# EAGLE schematic BMS (EAGLE 7.5.0)
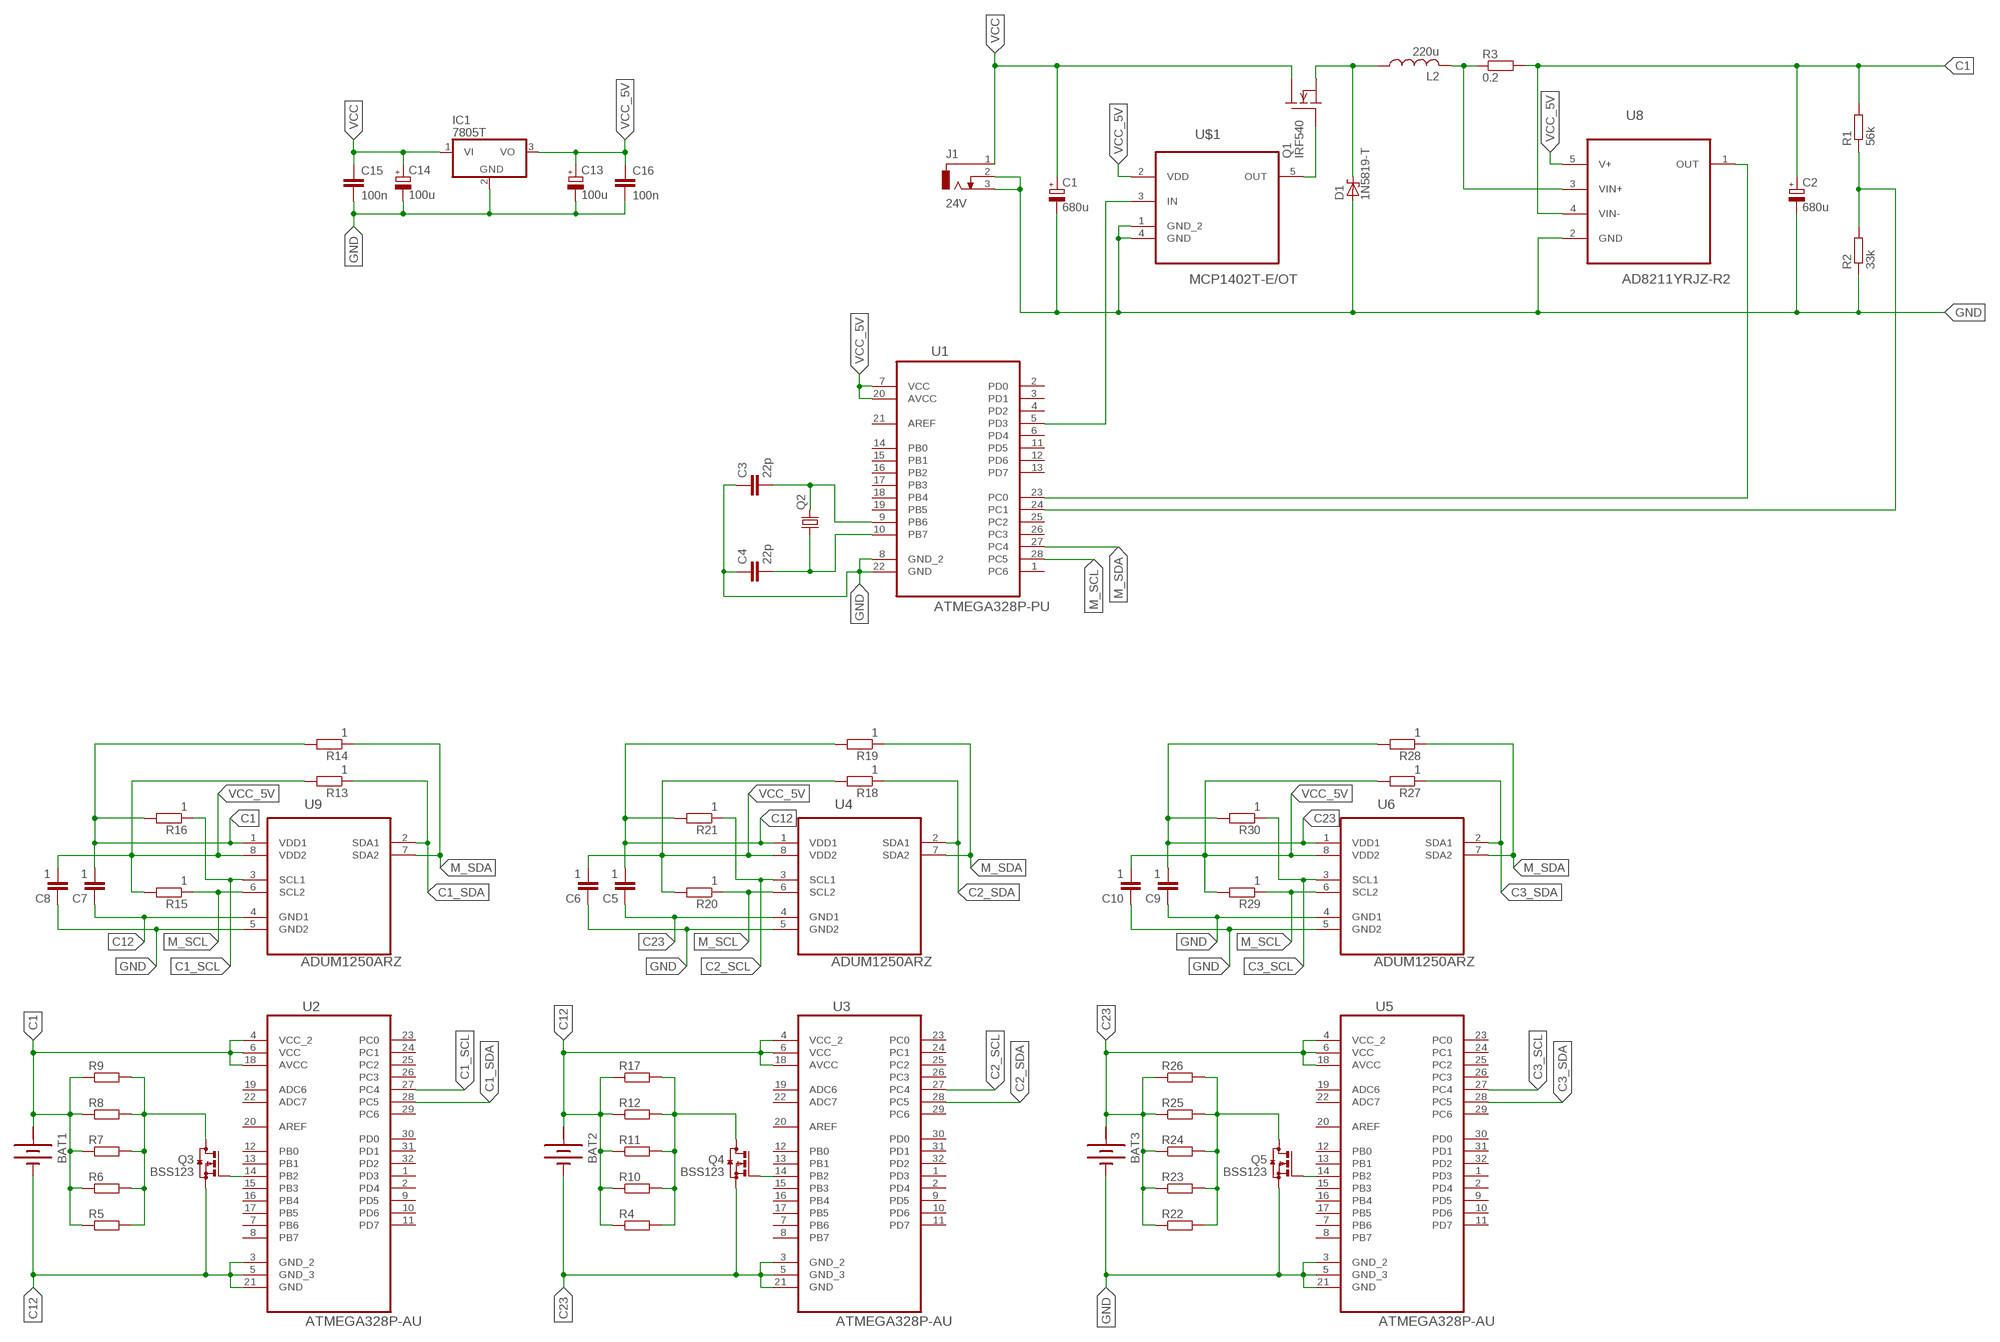
[diagram p0: schematic, sheet 1]

## Parts
BAT1  BATTERY  [BATTERY]
BAT2  BATTERY  [BATTERY]
BAT3  BATTERY  [BATTERY]
C1  680u  CPOL-EUE3.5-8  [E3,5-8]
C2  680u  CPOL-EUE3.5-8  [E3,5-8]
C3  22p  C-EUC0805  [C0805]
C4  22p  C-EUC0805  [C0805]
C5  1  C-EUC0805  [C0805]
C6  1  C-EUC0805  [C0805]
C7  1  C-EUC0805  [C0805]
C8  1  C-EUC0805  [C0805]
C9  1  C-EUC0805  [C0805]
C10  1  C-EUC0805  [C0805]
C13  100u  CPOL-EUB45181A  [B45181A]
C14  100u  CPOL-EUB45181A  [B45181A]
C15  100n  C-EUC0805  [C0805]
C16  100n  C-EUC0805  [C0805]
D1  1N5819-T  [DO41-7.6]
IC1  7805T  [TO220H]
J1  24V  DCJ0303  [DCJ0303]
L2  220u  L-USTJ9-U1  [TJ9-U1]
Q1  IRF540  [TO220]
Q2  CRYSTALHC49S  [HC49/S]
Q3  BSS123  [SOT23]
Q4  BSS123  [SOT23]
Q5  BSS123  [SOT23]
R1  56k  R-EU_R0805  [R0805]
R2  33k  R-EU_R0805  [R0805]
R3  0.2  R-EU_R0805  [R0805]
R4  R-EU_R0805  [R0805]
R5  R-EU_R0805  [R0805]
R6  R-EU_R0805  [R0805]
R7  R-EU_R0805  [R0805]
R8  R-EU_R0805  [R0805]
R9  R-EU_R0805  [R0805]
R10  R-EU_R0805  [R0805]
R11  R-EU_R0805  [R0805]
R12  R-EU_R0805  [R0805]
R13  1  R-EU_R0805  [R0805]
R14  1  R-EU_R0805  [R0805]
R15  1  R-EU_R0805  [R0805]
R16  1  R-EU_R0805  [R0805]
R17  R-EU_R0805  [R0805]
R18  1  R-EU_R0805  [R0805]
R19  1  R-EU_R0805  [R0805]
R20  1  R-EU_R0805  [R0805]
R21  1  R-EU_R0805  [R0805]
R22  R-EU_R0805  [R0805]
R23  R-EU_R0805  [R0805]
R24  R-EU_R0805  [R0805]
R25  R-EU_R0805  [R0805]
R26  R-EU_R0805  [R0805]
R27  1  R-EU_R0805  [R0805]
R28  1  R-EU_R0805  [R0805]
R29  1  R-EU_R0805  [R0805]
R30  1  R-EU_R0805  [R0805]
U1  ATMEGA328P-PU  [DIP254P762X457-28]
U2  ATMEGA328P-AU  [QFP80P900X900X120-32N]
U3  ATMEGA328P-AU  [QFP80P900X900X120-32N]
U4  ADUM1250ARZ  [SOIC127P600X175-8N]
U5  ATMEGA328P-AU  [QFP80P900X900X120-32N]
U6  ADUM1250ARZ  [SOIC127P600X175-8N]
U8  AD8211YRJZ-R2  [SOT95P280X145-5N]
U9  ADUM1250ARZ  [SOIC127P600X175-8N]
U$1  MCP1402T-E/OT  [SOT95P270X145-5N]

## Nets
C1: BAT1.+ C2.+ C7.2 R1.2 R3.2 R5.1 R6.1 R7.1 R8.1 R9.1 R14.2 R16.2 U2.4(VCC_2) U2.6(VCC) U2.18(AVCC) U8.4(VIN-) U9.1(VDD1)
C1_SCL: R16.1 U2.27(PC4) U9.3(SCL1)
C1_SDA: R13.1 U2.28(PC5) U9.2(SDA1)
C2_SCL: R21.1 U3.27(PC4) U4.3(SCL1)
C2_SDA: R18.1 U3.28(PC5) U4.2(SDA1)
C3_SCL: R30.1 U5.27(PC4) U6.3(SCL1)
C3_SDA: R27.1 U5.28(PC5) U6.2(SDA1)
C12: BAT1.- BAT2.+ C5.2 C7.1 Q3.2(S) R4.1 R10.1 R11.1 R12.1 R17.1 R19.2 R21.2 U2.3(GND_2) U2.5(GND_3) U2.21(GND) U3.4(VCC_2) U3.6(VCC) U3.18(AVCC) U4.1(VDD1) U9.4(GND1)
C23: BAT2.- BAT3.+ C5.1 C9.2 Q4.2(S) R22.1 R23.1 R24.1 R25.1 R26.1 R28.2 R30.2 U3.3(GND_2) U3.5(GND_3) U3.21(GND) U4.4(GND1) U5.4(VCC_2) U5.6(VCC) U5.18(AVCC) U6.1(VDD1)
GND: BAT3.- C1.- C2.- C3.1 C4.1 C6.1 C8.1 C9.1 C10.1 C13.- C14.- C15.2 C16.2 D1.A IC1.2(GND) J1.2 J1.3 Q5.2(S) R2.1 U1.8(GND_2) U1.22(GND) U4.5(GND2) U5.3(GND_2) U5.5(GND_3) U5.21(GND) U6.4(GND1) U6.5(GND2) U8.2(GND) U9.5(GND2) U$1.1(GND_2) U$1.4(GND)
M_SCL: R15.1 R20.1 R29.1 U1.28(PC5) U4.6(SCL2) U6.6(SCL2) U9.6(SCL2)
M_SDA: R14.1 R19.1 R28.1 U1.27(PC4) U4.7(SDA2) U6.7(SDA2) U9.7(SDA2)
N$2: C3.2 Q2.2 U1.9(PB6)
N$3: D1.C L2.1 Q1.3(S)
N$4: U1.5(PD3) U$1.3(IN)
N$5: Q1.1(G) U$1.5(OUT)
N$6: L2.2 R3.1 U8.3(VIN+)
N$7: R1.1 R2.2 U1.24(PC1)
N$8: C4.2 Q2.1 U1.10(PB7)
N$9: U1.23(PC0) U8.1(OUT)
N$13: Q3.3(D) R5.2 R6.2 R7.2 R8.2 R9.2
N$14: Q3.1(G) U2.14(PB2)
N$16: Q4.3(D) R4.2 R10.2 R11.2 R12.2 R17.2
N$17: Q4.1(G) U3.14(PB2)
N$24: Q5.3(D) R22.2 R23.2 R24.2 R25.2 R26.2
N$25: Q5.1(G) U5.14(PB2)
VCC: C1.+ C14.+ C15.1 IC1.1(VI) J1.1 Q1.2(D)
VCC_5V: C6.2 C8.2 C10.2 C13.+ C16.1 IC1.3(VO) R13.2 R15.2 R18.2 R20.2 R27.2 R29.2 U1.7(VCC) U1.20(AVCC) U4.8(VDD2) U6.8(VDD2) U8.5(V+) U9.8(VDD2) U$1.2(VDD)
Unconnected: U1.1(PC6) U1.2(PD0) U1.3(PD1) U1.4(PD2) U1.6(PD4) U1.11(PD5) U1.12(PD6) U1.13(PD7) U1.14(PB0) U1.15(PB1) U1.16(PB2) U1.17(PB3) U1.18(PB4) U1.19(PB5) U1.21(AREF) U1.25(PC2) U1.26(PC3) U2.1(PD3) U2.2(PD4) U2.7(PB6) U2.8(PB7) U2.9(PD5) U2.10(PD6) U2.11(PD7) U2.12(PB0) U2.13(PB1) U2.15(PB3) U2.16(PB4) U2.17(PB5) U2.19(ADC6) U2.20(AREF) U2.22(ADC7) U2.23(PC0) U2.24(PC1) U2.25(PC2) U2.26(PC3) U2.29(PC6) U2.30(PD0) U2.31(PD1) U2.32(PD2) U3.1(PD3) U3.2(PD4) U3.7(PB6) U3.8(PB7) U3.9(PD5) U3.10(PD6) U3.11(PD7) U3.12(PB0) U3.13(PB1) U3.15(PB3) U3.16(PB4) U3.17(PB5) U3.19(ADC6) U3.20(AREF) U3.22(ADC7) U3.23(PC0) U3.24(PC1) U3.25(PC2) U3.26(PC3) U3.29(PC6) U3.30(PD0) U3.31(PD1) U3.32(PD2) U5.1(PD3) U5.2(PD4) U5.7(PB6) U5.8(PB7) U5.9(PD5) U5.10(PD6) U5.11(PD7) U5.12(PB0) U5.13(PB1) U5.15(PB3) U5.16(PB4) U5.17(PB5) U5.19(ADC6) U5.20(AREF) U5.22(ADC7) U5.23(PC0) U5.24(PC1) U5.25(PC2) U5.26(PC3) U5.29(PC6) U5.30(PD0) U5.31(PD1) U5.32(PD2)

## Power pins joined to a net without a drawn wire
+: BAT1.+@1(+) BAT2.+@1(+) BAT3.+@1(+)

## Library data of the parts
BAT1-BAT3 = special:BATTERY: BATTERY; OC_FARNELL: unknown
C1 C2 C13 C14 = rcl:CPOL-EU: POLARIZED CAPACITOR, European symbol
C3-C10 C15 C16 = rcl:C-EU: CAPACITOR, European symbol
D1 = diode:1N581*: 1.0A SCHOTTKY BARRIER RECTIFIER Source: http://www.diodes.com/datasheets/ds23001.pdf
IC1 = linear:78*: Positive VOLTAGE REGULATOR Source: http://cache.national.com/ds/LM/LM78L05.pdf http://www.fairchildsemi.com/ds/LM/LM7805.pdf
J1 = con-jack:DCJ0303: DC POWER JACK Source: DCJ0303.pdf; OC_FARNELL: unknown; OC_NEWARK: unknown
L2 = rcl:L-US: INDUCTOR, American symbol
Q1 = transistor-fet:IRF540: N-Channel Enhancement MOSFET (HEXFET); 100V; 28A; 0,077Ohm
Q2 = crystal:CRYSTAL: CRYSTAL; OC_FARNELL: 1667008; OC_NEWARK: unknown
Q3-Q5 = transistor-small-signal:BSS123: N-CHANNEL MOS FET
R1-R30 = rcl:R-EU_: RESISTOR, European symbol
U1 = Atmel_By_element14_Batch_1-00:ATMEGA328P-PU: 8-bit Microcontroller with In-System Programmable Flash; MF: ATMEL; MPN: ATMEGA328P-PU; OC_FARNELL: 1715487; OC_NEWARK: 15R0268; PACKAGE: PDIP-28; SUPPLIER: Atmel
U2 U3 U5 = Atmel_By_element14_Batch_1-00:ATMEGA328P-AU: 8-bit Microcontroller with In-System Programmable Flash; MF: ATMEL; MPN: ATMEGA328P-AU; OC_FARNELL: 1715486; OC_NEWARK: 14R4631; PACKAGE: TQFP-32; SUPPLIER: Atmel
U4 U6 U9 = Analog Devices_By_element14_Batch_1:ADUM1250ARZ: Hot Swappable, Dual I2C Isolators; MF: ANALOG DEVICES; MPN: ADUM1250ARZ; OC_FARNELL: 1814353; OC_NEWARK: 27M9880; PACKAGE: SOIC-8; SUPPLIER: Analog Devices
U8 = Analog Devices_By_element14_Batch_1:AD8211YRJZ-R2: High Voltage Current Shunt Monitor; MPN: AD8211YRJZ-R2; OC_FARNELL: 1838885; OC_NEWARK: 52M2972; PACKAGE: SOT-23-5; SUPPLIER: Analog Devices
U$1 = Microchip_By_element14_Batch_1:MCP1402T-E/OT: High-Speed Power MOSFET Driver; MPN: MCP1402T-E/OT; OC_FARNELL: 1439711; OC_NEWARK: 54M4816; PACKAGE: SOT-5; SUPPLIER: Microchip